# Altium schematic sheet Soldeerbout_P1.SchDoc: Soldeerbout
size A4; DrawnBy: Boghe Tim; Revision: 01; SheetNumber: 1; SheetTotal: 5; Number: PXL2022-0001
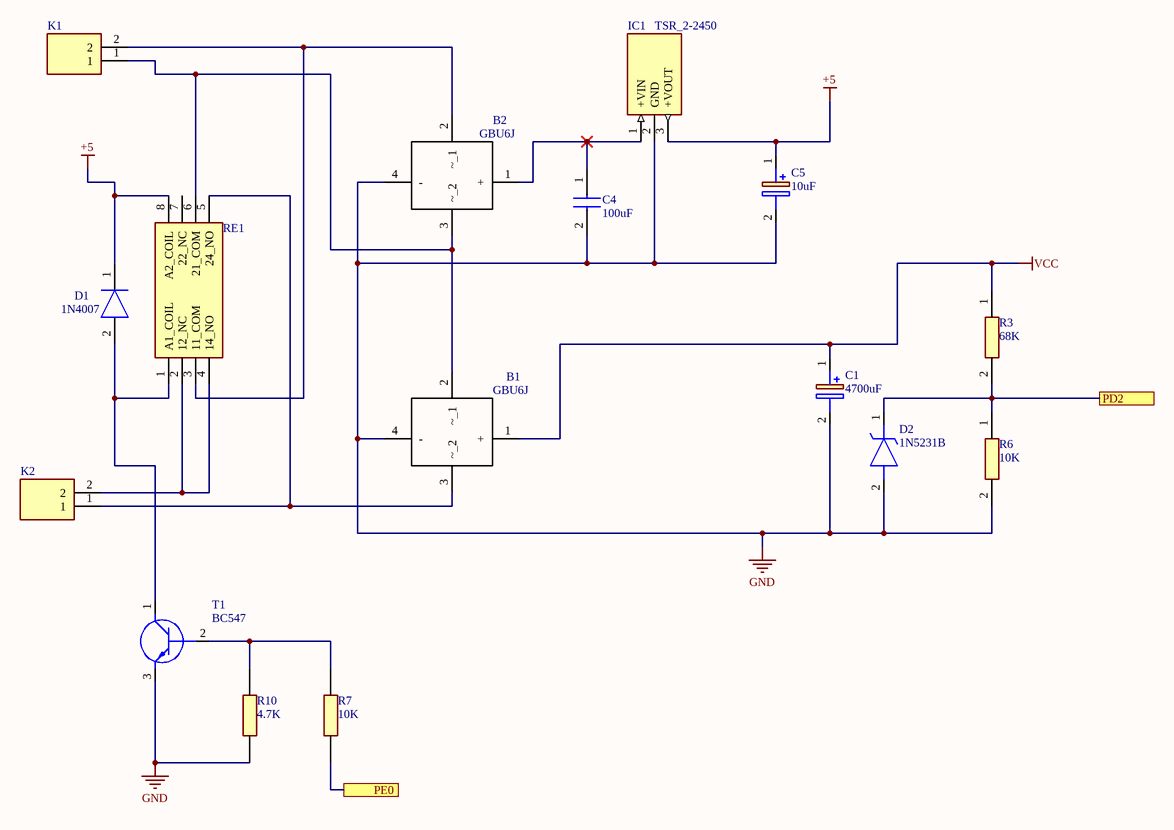
[diagram p0: Soldeerbout_P1.SchDoc]

## Parts
B1  GBU6J  [B1,2 GBU6J 600V 6 A]
B2  GBU6J  [B1,2 GBU6J 600V 6 A]
C1  4700uF  [C 50V 4700uF]
C4  100uF  [CAPPRD350W52D800H1300]
C5  10uF  [C 50V 10µF]
D1  1N4007  [1N4007]
D2  1N5231B  [1N5231B 5.1V 0.5W]
IC1  TSR_2-2450  [IC1 TSR-2]
K1  (no value)  [K printkroonsteen 5.08]
K2  (no value)  [K printkroonsteen 5.08]
R3  68K  [0805]
R6  10K  [0805]
R7  10K  [0805]
R10  4.7K  [0805]
RE1  5 VDC 8A  [relais 5V 8A]  (value not drawn)
T1  BC547  [T1,2,4 BC547C 45V 100mA]

## Ports
PD2, PE0

## Nets
+5: C5.1(+) D1.1(K) IC1.3(+VOUT) RE1.8(A2_COIL)
GND: B1.4(-) B2.4(-) C1.2(-) C4.2(-) C5.2(-) D2.2(A) IC1.2(GND) R6.2 R10.2 T1.3(E)
VCC: B1.1(+) C1.1(+) R3.1
PD2: D2.1(K) R3.2 R6.1 ; port PD2
PE0: R7.2 ; port PE0
NetB1_2: B1.2(~_1) B2.3(~_2) K1.1 RE1.6(21_COM)
NetB1_3: B1.3(~_2) K2.1 RE1.5(24_NO)
NetB2_1: B2.1(+) C4.1(+) IC1.1(+VIN)
NetB2_2: B2.2(~_1) K1.2 RE1.3(11_COM)
NetD1_2: D1.2(A) RE1.1(A1_COIL) T1.1(C)
NetK2_2: K2.2 RE1.2(12_NC) RE1.4(14_NO)
NetR7_1: R7.1 R10.1 T1.2(B)

Not connected (* = marked no-connect by the designer): RE1 7(22_NC)

## Library data of the parts
B1 B2 = GBU6J: Bridge Rectifier; Manufacturer_Name: GeneSiC Semiconductor; Datasheet Link: https://www.diodemodule.com/silicon_products/bridge_rectifiers/gbu6j.pdf; Height: 18.8mm; Manufacturer_Part_Number: GBU6J
C1 = ESK478M050AQ3AA: Capacitor Polarised; Manufacturer_Name: Kemet; Datasheet Link: https://componentsearchengine.com//ESK478M050AQ3AA.pdf; Height: 37mm; Mouser2 Part Number: 80-ESK478M050AQ3AA; Mouser2 Price/Stock: https://www.mouser.com/Search/Refine.aspx?Keyword=80-ESK478M050AQ3AA; Manufacturer_Part_Number: ESK478M050AQ3AA
C4 = 860020674015: Capacitor; Manufacturer_Name: Wurth Elektronik; Datasheet Link: https://www.we-online.com/catalog/datasheet/860020674015.pdf; Height: 13mm; Manufacturer_Part_Number: 860020674015
C5 = ESS106M050AE2AA: Capacitor Polarised; Manufacturer_Name: Kemet; Datasheet Link: https://content.kemet.com/datasheets/KEM_A4057_ESS.pdf; Height: 8.5mm; Manufacturer_Part_Number: ESS106M050AE2AA
D1 = RL1N4007-T: Diode; Manufacturer_Name: Rectron; Datasheet Link: https://www.mouser.in/datasheet/2/345/rl1n4001-rl1n4007-35989.pdf; Manufacturer_Part_Number: RL1N4007-T
D2 = 1N5231B: Zener Diode; Manufacturer_Name: ON Semiconductor; Manufacturer_Part_Number: 1N5231B
IC1 = TSR_2-2450: Power Supply; Manufacturer_Name: Traco Power; Manufacturer_Part_Number: TSR 2-2450; Datasheet Link: https://componentsearchengine.com//TSR 2-2450.pdf; Mouser2 Part Number: 495-TSR2-2450; Mouser2 Price/Stock: https://www.mouser.com/Search/Refine.aspx?Keyword=495-TSR2-2450
K1 K2 = TB007-508-02BE: Connector; Manufacturer_Name: CUI Inc.; Datasheet Link: https://componentsearchengine.com//TB007-508-02BE.pdf; Height: 14mm; Mouser2 Part Number: 490-TB007-508-02BE; Mouser2 Price/Stock: https://www.mouser.com/Search/Refine.aspx?Keyword=490-TB007-508-02BE; Manufacturer_Part_Number: TB007-508-02BE
R3 R6 R7 R10 = ESR10EZPJ183: Resistor; Manufacturer_Name: ROHM Semiconductor; Datasheet Link: https://datasheet.datasheetarchive.com/originals/distributors/Datasheets_SAMA/30ccb516c688c96e56c83a00b77a93f4.pdf; Height: 0.65mm; Manufacturer_Part_Number: ESR10EZPJ183
RE1 = RT424005: Relay or Contactor; Manufacturer_Name: TE Connectivity; Datasheet Link: https://componentsearchengine.com//RT424005.pdf; Mouser2 Part Number: 655-RT424005; Mouser2 Price/Stock: https://www.mouser.com/Search/Refine.aspx?Keyword=655-RT424005; Manufacturer_Part_Number: RT424005
T1 = BC547CBU: Transistor BJT NPN; Manufacturer_Name: ON Semiconductor; Datasheet Link: https://www.onsemi.com/pdf/datasheet/bc550-d.pdf; Height: 5.33mm; Manufacturer_Part_Number: BC547CBU